# Altium schematic sheet PowerSupply.SchDoc: Iris
size A3; Organization: Toradex AG; Address1: Altsagenstrasse 5; Address2: Horw; Address3: 6048; Address4: Switzerland; DocumentNumber: 3; Revision: V2.0; SheetNumber: 3; SheetTotal: 16
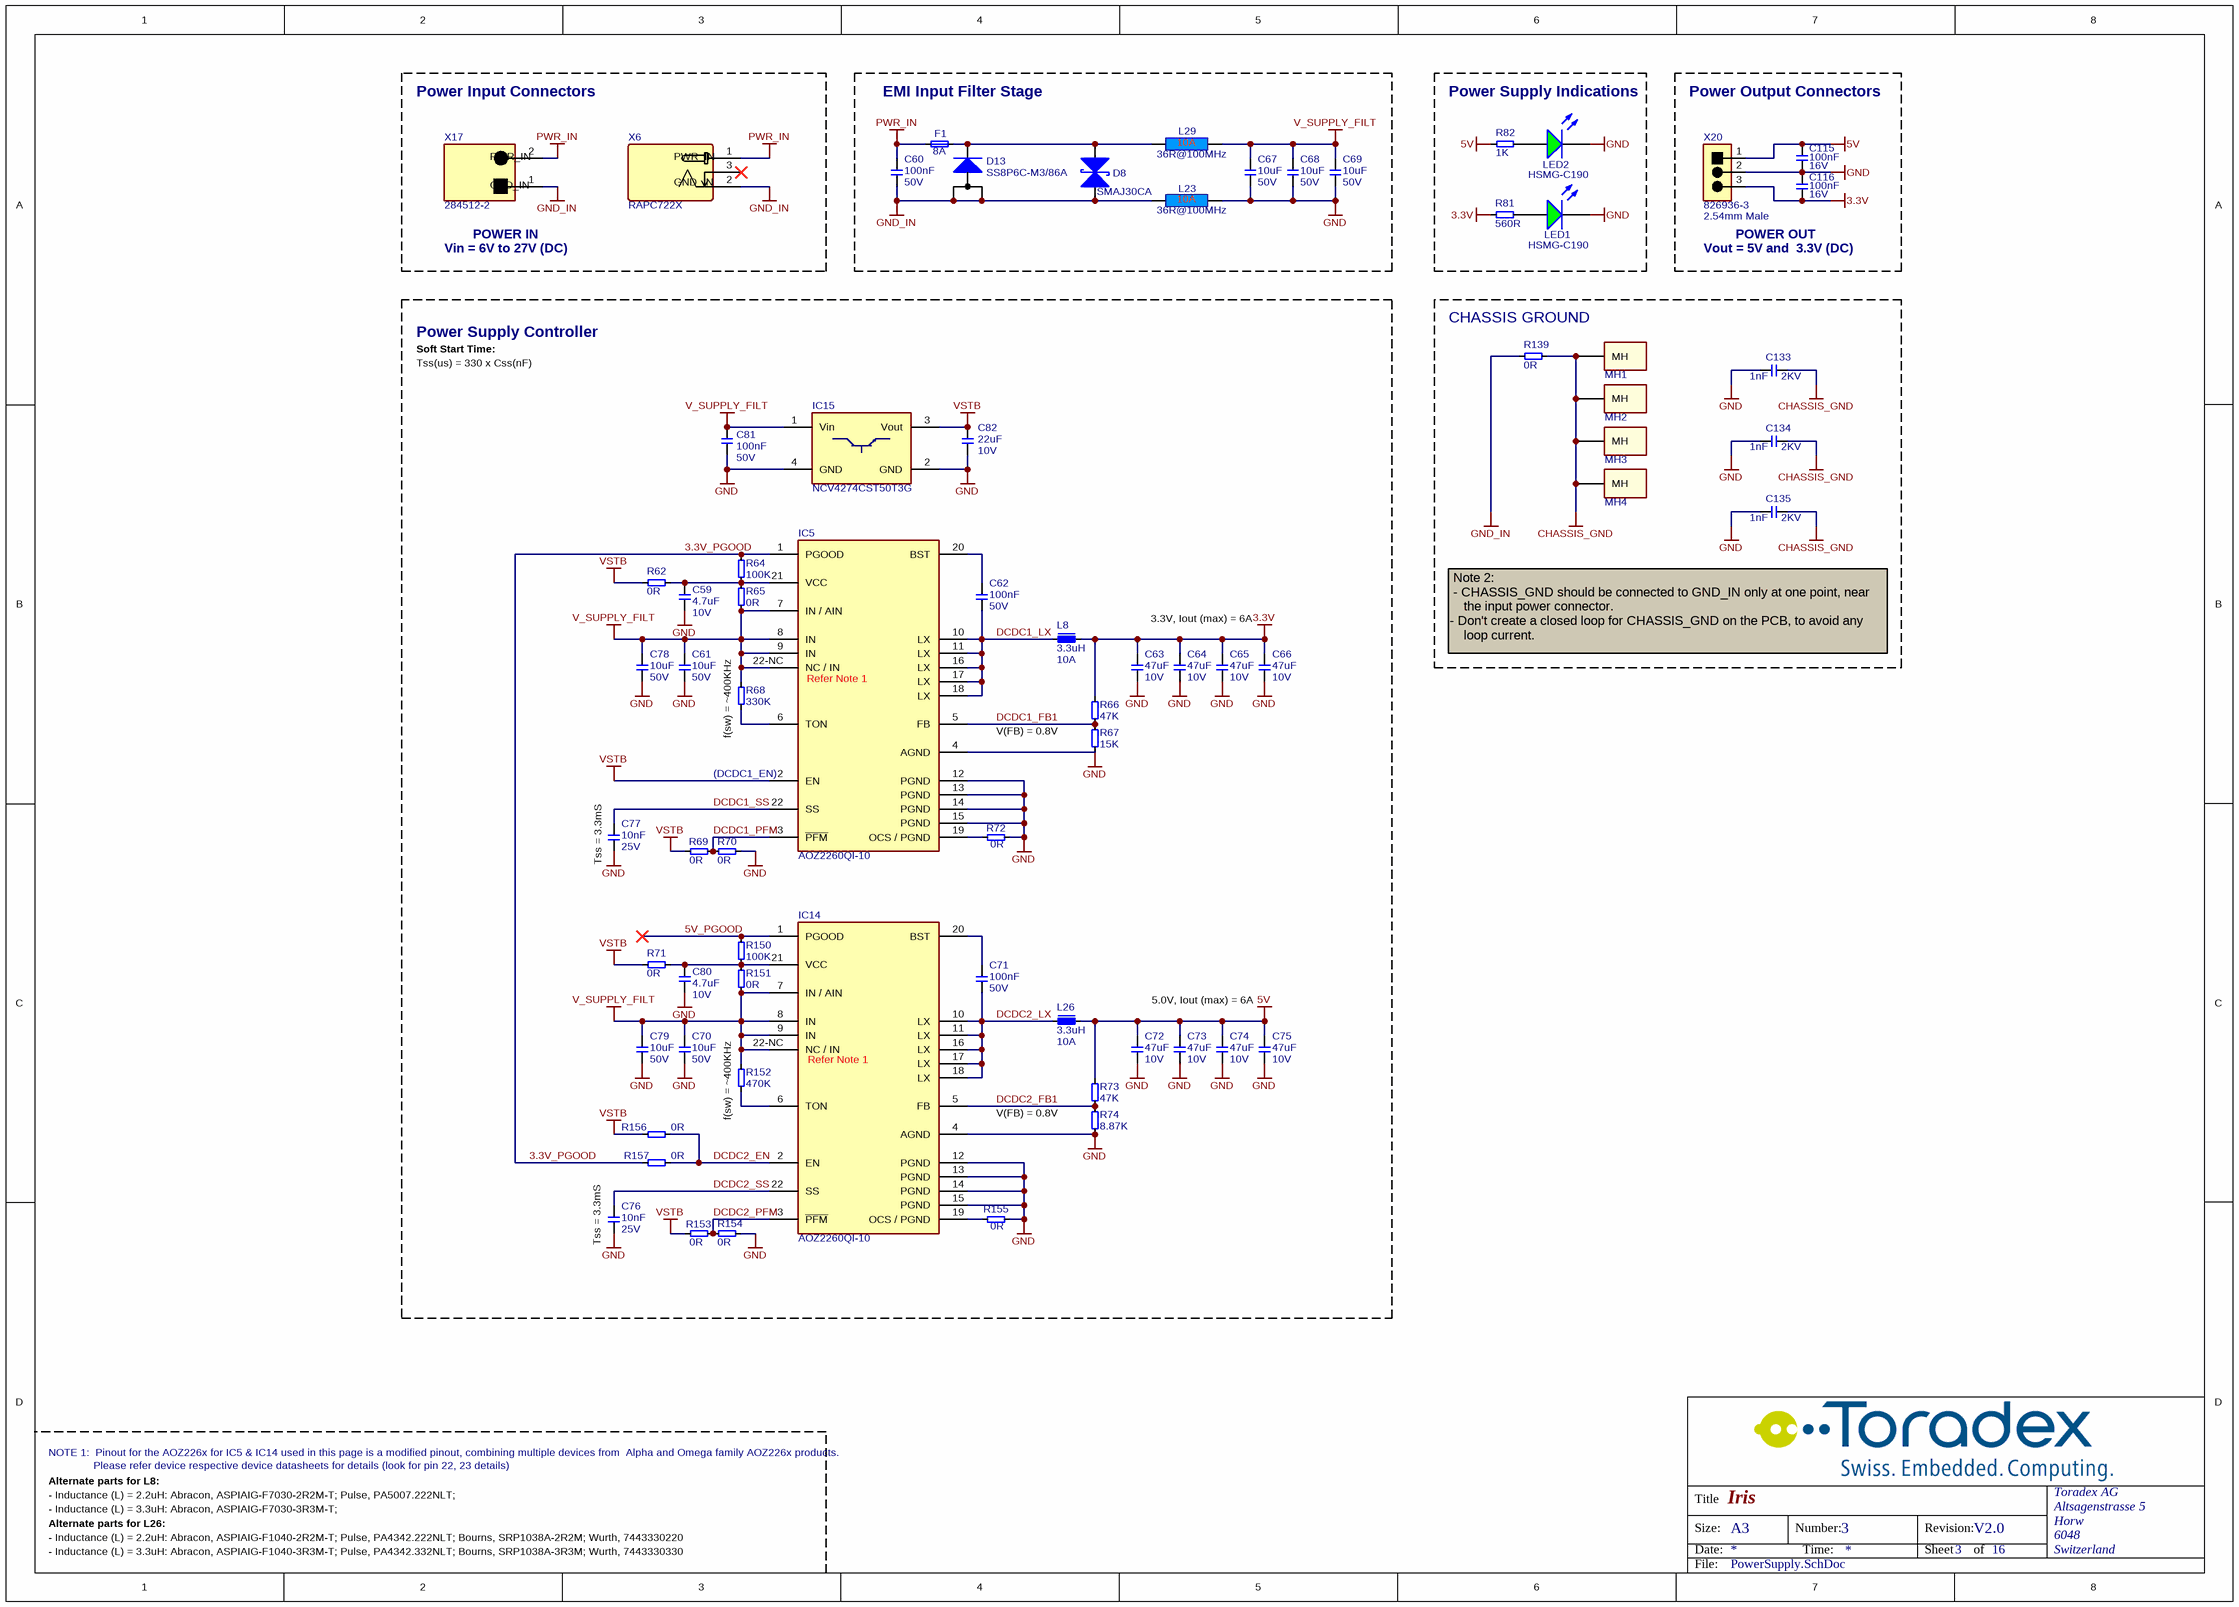
[diagram p0: PowerSupply.SchDoc]

## Parts
C59  Rating: 10V  [T_CAPC0603X33N]  (hidden comment: 4.7uF)
C60  Rating: 50V  [T_CAPC0603X33N]  (hidden comment: 100nF)
C61  Rating: 50V  [CAPC3225X160N]  (hidden comment: 10uF)
C62  Rating: 50V  [T_CAPC0603X33N]  (hidden comment: 100nF)
C63  Rating: 10V  [T_CAPC0805X125N]  (hidden comment: 47uF)
C64  Rating: 10V  [T_CAPC0805X125N]  (hidden comment: 47uF)
C65  Rating: 10V  [T_CAPC0805X125N]  (hidden comment: 47uF)
C66  Rating: 10V  [T_CAPC0805X125N]  (hidden comment: 47uF)
C67  Rating: 50V  [CAPC3225X160N]  (hidden comment: 10uF)
C68  Rating: 50V  [CAPC3225X160N]  (hidden comment: 10uF)
C69  Rating: 50V  [CAPC3225X160N]  (hidden comment: 10uF)
C70  Rating: 50V  [CAPC3225X160N]  (hidden comment: 10uF)
C71  Rating: 50V  [T_CAPC0603X33N]  (hidden comment: 100nF)
C72  Rating: 10V  [T_CAPC0805X125N]  (hidden comment: 47uF)
C73  Rating: 10V  [T_CAPC0805X125N]  (hidden comment: 47uF)
C74  Rating: 10V  [T_CAPC0805X125N]  (hidden comment: 47uF)
C75  Rating: 10V  [T_CAPC0805X125N]  (hidden comment: 47uF)
C76  Rating: 25V  [CAPC1005X60N]  (hidden comment: 10nF)
C77  Rating: 25V  [CAPC1005X60N]  (hidden comment: 10nF)
C78  Rating: 50V  [CAPC3225X160N]  (hidden comment: 10uF)
C79  Rating: 50V  [CAPC3225X160N]  (hidden comment: 10uF)
C80  Rating: 10V  [T_CAPC0603X33N]  (hidden comment: 4.7uF)
C81  Rating: 50V  [T_CAPC0603X33N]  (hidden comment: 100nF)
C82  Rating: 10V  [T_CAPC0805X125N]  (hidden comment: 22uF)
C115  Rating: 16V  [CAPC1005X60N]  (hidden comment: 100nF)
C116  Rating: 16V  [CAPC1005X60N]  (hidden comment: 100nF)
C133  Rating: 2KV  [T_CAPC1206X180N]  (hidden comment: 1nF)
C134  Rating: 2KV  [T_CAPC1206X180N]  (hidden comment: 1nF)
C135  Rating: 2KV  [T_CAPC1206X180N]  (hidden comment: 1nF)
D8  Manufacturer Part No.: SMAJ30CA  [T_LITTLEFUSE_SMAJ30CA]  (hidden comment: D-Littelfuse-SMAJ30CA-Schottky)
D13  SS8P6C-M3/86A  [T_DIOM_TO277A]
F1  8A  [T_Littelfuse_0458]
IC5  AOZ2260QI-10  [T_QFN50P400X400X100-23N (AOZ226x) - PIN22-NC_NOPASTE]
IC14  AOZ2260QI-10  [T_QFN50P400X400X100-23N (AOZ226x) - PIN22-NC_NOPASTE]
IC15  NCV4274CST50T3G  [T_ON_NCV4264-2ST50T3G]
L8  Rating: 10A  [T_INDM780760]  (hidden comment: 3.3uH)
L23  36R@100MHz  [T_Laird_35F0121-0SR-10]
L26  Rating: 10A  [T_INDM110100]  (hidden comment: 3.3uH)
L29  36R@100MHz  [T_Laird_35F0121-0SR-10]
LED1  Manufacturer Part No.: HSMG-C190  [LEDC1608X80N]  (hidden comment: LED)
LED2  Manufacturer Part No.: HSMG-C190  [LEDC1608X80N]  (hidden comment: LED)
MH1  MECH-MountingHoles  [T_MountingHoles]  (value not drawn)  (no BOM)
MH2  MECH-MountingHoles  [T_MountingHoles]  (value not drawn)  (no BOM)
MH3  MECH-MountingHoles  [T_MountingHoles]  (value not drawn)  (no BOM)
MH4  MECH-MountingHoles  [T_MountingHoles]  (value not drawn)  (no BOM)
R62  0R  [T_RESC0603X30N]
R64  100K  [RESC1005X40N]
R65  0R  [T_RESC0603X30N]
R66  47K  [RESC1005X40N]
R67  15K  [RESC1005X40N]
R68  330K  [RESC1005X40N]
R69  0R  [T_RESC0603X30N]
R70  0R  [T_RESC0603X30N]
R71  0R  [T_RESC0603X30N]
R72  0R  [T_RESC0603X30N]
R73  47K  [RESC1005X40N]
R74  8.87K  [RESC1005X40N]
R81  560R  [RESC1005X40N]
R82  1K  [RESC1005X40N]
R139  0R  [T_RESC3216X760N]
R150  100K  [RESC1005X40N]
R151  0R  [T_RESC0603X30N]
R152  470K  [RESC1005X40N]
R153  0R  [T_RESC0603X30N]
R154  0R  [T_RESC0603X30N]
R155  0R  [T_RESC0603X30N]
R156  0R  [T_RESC0603X30N]
R157  0R  [T_RESC0603X30N]
X6  RAPC722X  [T_RAPC722X]
X17  284512-2  [T_TYCO_284512-2]
X20  826936-3  [T_TYCO_826936-3]

## Blocks framed on the sheet
Power Input Connectors: X6 X17
EMI Input Filter Stage: C60 C67-C69 D8 D13 F1 L23 L29
Power Supply Indications: LED1 LED2 R81 R82
Power Output Connectors: C115 C116 X20
Power Supply Controller: C59 C61-C66 C70-C82 IC5 IC14 IC15 L8 L26 R62 R64-R74 R150-R157
CHASSIS GROUND: C133-C135 MH1-MH4 R139

## Nets
3.3V: C63.2 C64.2 C65.2 C66.2 C116.1 L8.2 R66.2 R81.2 X20.3
5V: C72.2 C73.2 C74.2 C75.2 C115.2 L26.2 R73.2 R82.2 X20.1
CHASSIS_GND: C133.1 C134.1 C135.1 MH1.1(MH) MH2.1(MH) MH3.1(MH) MH4.1(MH) R139.2
GND: C59.1 C61.1 C63.1 C64.1 C65.1 C66.1 C67.1 C68.1 C69.1 C70.1 C72.1 C73.1 C74.1 C75.1 C76.1 C77.1 C78.1 C79.1 C80.1 C81.1 C82.2 C115.1 C116.2 C133.2 C134.2 C135.2 IC5.4(AGND) IC5.12(PGND) IC5.13(PGND) IC5.14(PGND) IC5.15(PGND) IC14.4(AGND) IC14.12(PGND) IC14.13(PGND) IC14.14(PGND) IC14.15(PGND) IC15.2(GND) IC15.4(GND) L23.2 LED1.1(K) LED2.1(K) R67.1 R70.2 R72.1 R74.1 R154.2 R155.1 X20.2
GND_IN: C60.1 D8.2(Anode) D13.A1 D13.A2 L23.1 R139.1 X6.2(PWR_IN) X17.1(GND_IN)
PWR_IN: C60.2 F1.1 X6.1(GND_IN) X17.2(PWR_IN)
V_SUPPLY_FILT: C61.2 C67.2 C68.2 C69.2 C70.2 C78.2 C79.2 C81.2 IC5.7(IN_/_AIN) IC5.8(IN) IC5.9(IN) IC5.22-NC(NC_/_IN) IC14.7(IN_/_AIN) IC14.8(IN) IC14.9(IN) IC14.22-NC(NC_/_IN) IC15.1(Vin) L29.2 R65.1 R68.2 R151.1 R152.2
VSTB: C82.1 IC5.2(EN) IC15.3(Vout) R62.2 R69.1 R71.2 R153.1 R156.2
3.3V_PGOOD: IC5.1(PGOOD) R64.2 R157.2
5V_PGOOD: IC14.1(PGOOD) R150.2
DCDC1_FB1: IC5.5(FB) R66.1 R67.2
DCDC1_LX: C62.1 IC5.10(LX) IC5.11(LX) IC5.16(LX) IC5.17(LX) IC5.18(LX) L8.1
DCDC1_PFM: IC5.3(~{PFM}) R69.2 R70.1
DCDC1_SS: C77.2 IC5.22(SS)
DCDC2_EN: IC14.2(EN) R156.1 R157.1
DCDC2_FB1: IC14.5(FB) R73.1 R74.2
DCDC2_LX: C71.1 IC14.10(LX) IC14.11(LX) IC14.16(LX) IC14.17(LX) IC14.18(LX) L26.1
DCDC2_PFM: IC14.3(~{PFM}) R153.2 R154.1
DCDC2_SS: C76.2 IC14.22(SS)
NetC59_2: C59.2 IC5.21(VCC) R62.1 R64.1 R65.2
NetC62_2: C62.2 IC5.20(BST)
NetC71_2: C71.2 IC14.20(BST)
NetC80_2: C80.2 IC14.21(VCC) R71.1 R150.1 R151.2
NetD8_1: D8.1(Cathode) D13.K F1.2 L29.1
NetIC5_6: IC5.6(TON) R68.1
NetIC5_19: IC5.19(OCS_/_PGND) R72.2
NetIC14_6: IC14.6(TON) R152.1
NetIC14_19: IC14.19(OCS_/_PGND) R155.2
NetLED1_2: LED1.2(A) R81.1
NetLED2_2: LED2.2(A) R82.1

Not connected (* = marked no-connect by the designer): X6 3(PWR_IN)*

## Notes on the sheet
- (near X17) Vin = 6V to 27V (DC)
- (near X17) POWER IN
- Vout = 5V and  3.3V (DC)
- (near X20) 2.54mm Male
- POWER OUT
- Soft Start Time:
- Tss(us) = 330 x Css(nF)
- 3.3V, Iout (max) = 6A
- (near IC5) Refer Note 1
- Note 2:
  - CHASSIS_GND should be connected to GND_IN only at one point, near
  the input power connector.
  - Don't create a closed loop for CHASSIS_GND on the PCB, to avoid any
  loop current.
- (near R68) f(sw) = ~400KHz
- V(FB) = 0.8V
- (near IC5) (DCDC1_EN)
- (near C77) Tss = 3.3mS
- 5.0V, Iout (max) = 6A
- (near R152) f(sw) = ~400KHz
- (near IC14) Refer Note 1
- (near C76) Tss = 3.3mS
- NOTE 1:  Pinout for the AOZ226x for IC5 & IC14 used in this page is a modified pinout, combining multiple devices from  Alpha and Omega family AOZ226x products.
- Alternate parts for L8:
- Please refer device respective device datasheets for details (look for pin 22, 23 details)
- Alternate parts for L26:
- - Inductance (L) = 3.3uH: Abracon, ASPIAIG-F1040-3R3M-T; Pulse, PA4342.332NLT; Bourns, SRP1038A-3R3M; Wurth, 7443330330
- - Inductance (L) = 2.2uH: Abracon, ASPIAIG-F1040-2R2M-T; Pulse, PA4342.222NLT; Bourns, SRP1038A-2R2M; Wurth, 7443330220
- - Inductance (L) = 3.3uH: Abracon, ASPIAIG-F7030-3R3M-T;
- - Inductance (L) = 2.2uH: Abracon, ASPIAIG-F7030-2R2M-T; Pulse, PA5007.222NLT;
- Title
- Size:
- Date:
- A3
- Number:
- Time:
- Revision:
- Sheet
- of
- File:

## Library data of the parts
C59 C80 = C-X5R-4.7uF-10V-10%-0603: Capacitor Ceramic X5R 4.7uF 10V 10% 0603; Manufacturer Name: Generic; Tolerance: 10%; Type: X5R; Manufacturer Part No.: *; Value: 4.7uF
C60 C62 C71 C81 = C-X7R-100nF-50V-10%-0603: Capacitor Ceramic X7R 100nF 50V 10% 0603; Tolerance: 10%; Type: X7R; Value: 100nF
C61 C67-C70 C78 C79 = C-X5R-10uF-50V-10%-1210: Capacitor Ceramic X5R 10uF 50V 10% 1210; Tolerance: 10%; Type: X5R; Value: 10uF
C63-C66 C72-C75 = C-X5R-47uF-10V-20%-0805: Capacitor Ceramic X5R 47uF 10V 20% 0805; Tolerance: 20%; Type: X5R; Value: 47uF
C76 C77 = C-X7R-10nF-25V-10%-0402: Capacitor Ceramic X7R 10nF 25V 10% 0402; Tolerance: 10%; Type: X7R; Value: 10nF
C82 = C-X5R-22uF-10V-20%-0805: Capacitor Ceramic X5R 22uF 10V 20% 0805; Tolerance: 20%; Type: X5R; Value: 22uF
C115 C116 = C-X7R-100nF-16V-10%-0402: Capacitor Ceramic X7R 100nF 16V 10% 0402; Tolerance: 10%; Type: X7R; Value: 100nF
C133-C135 = C-X7R-1nF-2KV-10%-1206: Capacitor Ceramic X7R 1nF 2KV 10% 1206; Tolerance: 10%; Type: X7R; Value: 1nF
D8 = D-Littelfuse-SMAJ30CA-Schottky: Bidirectional ESD protection; Manufacturer Name: Littelfuse
D13 = D-Vishay-SS8P6C-M3/86A: Diode Schottky, SS8P6C-M3/86A, 60V(Vrrm), 8A(If); Manufacturer: Vishay; Manufacturer Part Number: SS8P6C-M3/86A
F1 = F-Littelfuse-0458008.DR: Fast Fuse, Rated 8A, 63V(DC), 1206 (3216 Metric); Manufacturer Part No.: 0458008.DR; Manufacturer Name: Littelfuse; Value: 8A
IC5 IC14 = IC-A&O-AOZ2260QI-10: 6A (Iout(max)) Synchronous Buck Regulator, QFN-22L (4mmx 4mm), Vin = 6.5V to 28V; Manufacturer Name: Alpha and Omega; Manufacturer Part No.: AOZ2260QI-10
IC15 = IC-ON-NCV4274CST50T3G: LDO regulator, Vout = 5V, Iout(max) = 0.4A, Vin = 5.5V to 40V, SOT-223; Manufacturer Name: ON Semiconductor; Manufacturer Part No.: NCV4274CST50T3G
L8 = L-Pulse-PA5007.332NLT-3.3uH-10A-20%: Inductance 3.3uH, 20%, Irms=10A, Isat=15A, DCR=18 mOhm; Manufacturer Name: Pulse; I (saturation): 15A; Tolerance: 20%; Manufacturer Part No.: PA5007.332NLT; I (RMS): 10A; Value: 3.3uH
L23 L29 = L-Laird-35F0121-0SR-10-10A-25%: Power Supply FB 10A; Tolerance: 25%; Rating: 10A; Value: 36R@100MHz
L26 = L-Laird-MGV10043R3M-10-3.3uH-10A-20%: Inductance 3.3uH, 20%, Irms=10A, Isat=18.6A, DCR=11.8 mOhm; Manufacturer Name: Laird; I (saturation): 18.6; I (RMS): 10; Tolerance: 20%; Manufacturer Part No.: MGV10043R3M-10; Value: 3.3uH
LED1 LED2 = LED-Avago-HSMG-C190: Surface mount LED green 20mA; Manufacturer Name: Avago
MH1-MH4 = MECH-MountingHoles: PCB Mounting Holes, hole diemeter = 3.2mm, pad diameter = 6.2mm
R62 R65 R69-R72 R151 R153-R157 = R-0R-63mW-5%-0603: Resistor 0 ohm 63mW 5% 0603; Rating: 63mW; Tolerance: 5%; Size: 0603 (In); Value: 0R
R64 R150 = R-100KR-63mW-5%-0402: Resistor 100 Kohm 63mW 5% 0402; Value: 100KR; Rating: 63mW; Tolerance: 5%
R66 R73 = R-47KR-63mW-1%-0402: Resistor 47 Kohm 63mW 1% 0402; Value: 47KR; Rating: 63mW; Tolerance: 1%
R67 = R-15KR-63mW-1%-0402: Resistor 15 Kohm 63mW 1% 0402; Value: 15KR; Rating: 63mW; Tolerance: 1%
R68 = R-330KR-63mW-1%-0402: Resistor 330 Kohm 63mW 1% 0402; Value: 330KR; Rating: 63mW; Tolerance: 1%
R74 = R-8.87KR-63mW-1%-0402: Resistor 8.87 Kohm 63mW 1% 0402; Value: 8.87KR; Rating: 63mW; Tolerance: 1%
R81 = R-560R-63mW-5%-0402: Resistor 560 ohm 63mW 5% 0402; Rating: 63mW; Tolerance: 5%; Value: 560R
R82 = R-1KR-63mW-5%-0402: Resistor 1 Kohm 63mW 5% 0402; Rating: 63mW; Tolerance: 5%; Value: 1K
R139 = R-0R-63mW-1%-1206: Resistor 0 ohm 63mW 1% 1206; Rating: 63mW; Tolerance: 1%; Value: 0R
R152 = R-470KR-63mW-1%-0402: Resistor 470 Kohm 63mW 1% 0402; Value: 470KR; Rating: 63mW; Tolerance: 1%
X6 = CON-SwitchCraft-RAPC722X: Barrel Power Connector; Manufacturer Part No.: RAPC722X; Manufacturer Name: SwitchCraft
X17 = CON-Tyco-284512-2-1x2-3.5mm: Terminal Block Power Connector; Manufacturer Name: Tyco; No. of ways: 1x2; Pitch: 3.5mm; Manufacturer Part No.: 284512-2
X20 = CON-Tyco-826936-3-1X3-2.54mm: Header, 3-Pin; Manufacturer Name: Tyco; No. of ways: 1X3; Pitch: 2.54mm; Manufacturer Part No.: 826936-3